# Altium project Jackson.PrjPcb (part 1 of 2)
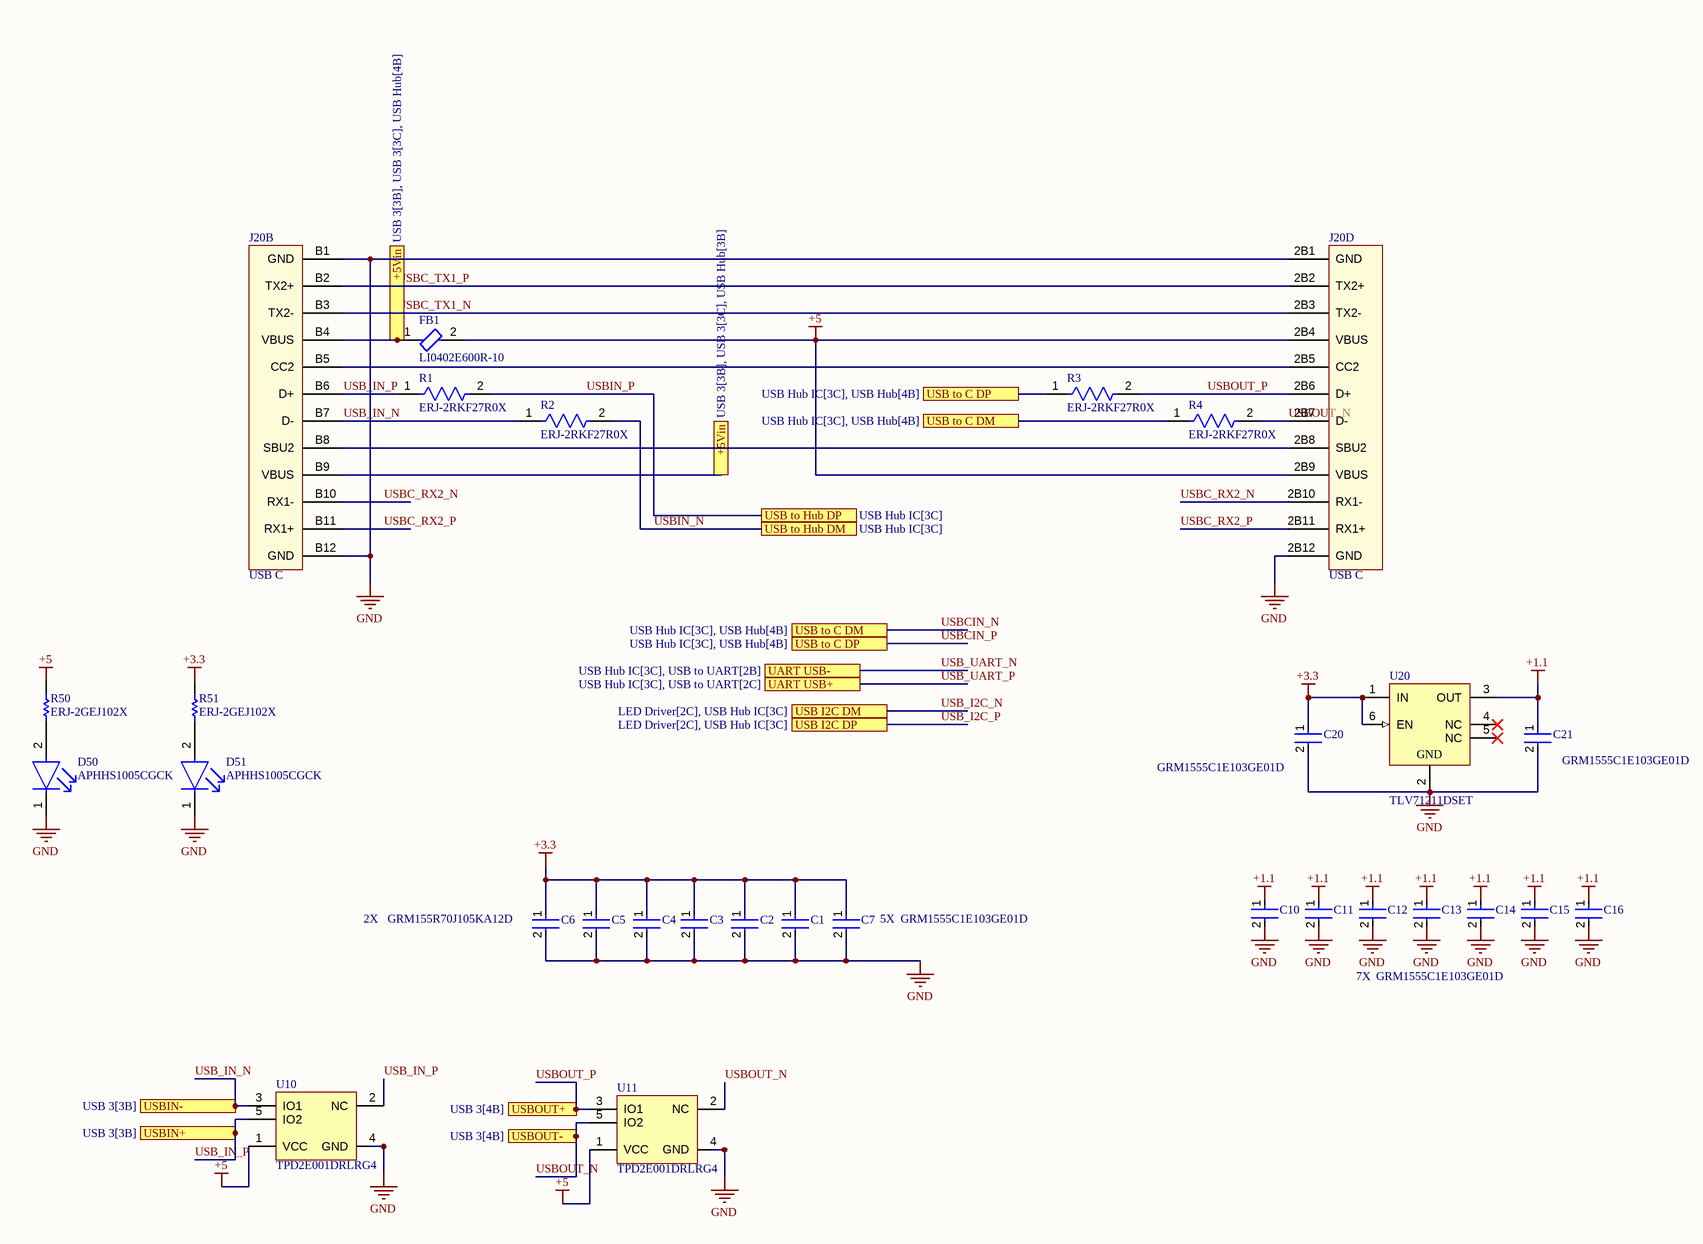
[diagram p0: USB Hub.SchDoc]
Scientist_Name_Possessive: MARY JACKSON'S; Scientist_Name: MARY JACKSON; Project_Name: JACKSON HEAD CONTROLLER; GPN_PCBA: 1184769
7 sheets, 125 parts. Net scope: flat (ports and power ports of the same name join across sheets).
Board file: Jackson.PcbDoc
Sheets:
  USB Hub.SchDoc
  USB Hub IC.SchDoc
  LED Driver.SchDoc
  USB to UART.SchDoc
  STO.SchDoc
  USB 3.SchDoc
  USB Audio.SchDoc

## Sheet USB Hub.SchDoc
size 420 x 297 mm; SheetNumber: 1; SheetTotal: 7

### Parts
C1  GRM1555C1E103GE01D  [FP-GRM155-0_15-IPC_B]  (value not drawn)
C2  GRM1555C1E103GE01D  [FP-GRM155-0_15-IPC_B]  (value not drawn)
C3  GRM1555C1E103GE01D  [FP-GRM155-0_15-IPC_B]  (value not drawn)
C4  GRM1555C1E103GE01D  [FP-GRM155-0_15-IPC_B]  (value not drawn)
C5  GRM155R70J105KA12D  [FP-GRM155-0_05-MFG]  (value not drawn)
C6  GRM155R70J105KA12D  [FP-GRM155-0_05-MFG]
C7  GRM1555C1E103GE01D  [FP-GRM155-0_15-IPC_B]
C10  GRM1555C1E103GE01D  [FP-GRM155-0_15-IPC_B]
C11  GRM1555C1E103GE01D  [FP-GRM155-0_15-IPC_B]  (value not drawn)
C12  GRM1555C1E103GE01D  [FP-GRM155-0_15-IPC_B]  (value not drawn)
C13  GRM1555C1E103GE01D  [FP-GRM155-0_15-IPC_B]  (value not drawn)
C14  GRM1555C1E103GE01D  [FP-GRM155-0_15-IPC_B]  (value not drawn)
C15  GRM1555C1E103GE01D  [FP-GRM155-0_15-IPC_B]  (value not drawn)
C16  GRM1555C1E103GE01D  [FP-GRM155-0_15-IPC_B]  (value not drawn)
C20  GRM1555C1E103GE01D  [FP-GRM155-0_15-IPC_B]
C21  GRM1555C1E103GE01D  [FP-GRM155-0_15-IPC_B]
D50  APHHS1005CGCK  [FP-APHHS1005CGCK-MFG]
D51  APHHS1005CGCK  [FP-APHHS1005CGCK-MFG]
FB1  LI0402E600R-10  [FP-LI0402-MFG]
J20  USB C  [Dual USB C Connector]  (parts B,D of 5)
R1  ERJ-2RKF27R0X  [FP-ERJ2R-IPC_B]
R2  ERJ-2RKF27R0X  [FP-ERJ2R-IPC_B]
R3  ERJ-2RKF27R0X  [FP-ERJ2R-IPC_B]
R4  ERJ-2RKF27R0X  [FP-ERJ2R-IPC_B]
R50  ERJ-2GEJ102X  [RESC1005X40X25NL05T05]
R51  ERJ-2GEJ102X  [RESC1005X40X25NL05T05]
U10  TPD2E001DRLRG4  [DRL0005A_L]
U11  TPD2E001DRLRG4  [DRL0005A_L]
U20  TLV71211DSET  [DSE0006A_V]

### Ports
+5Vin (see USB 3[3B], USB 3[3C], USB Hub[3B]), +5Vin (see USB 3[3B], USB 3[3C], USB Hub[4B]), UART USB+ (see USB Hub IC[3C], USB to UART[2C]), UART USB- (see USB Hub IC[3C], USB to UART[2B]), USB I2C DM (see LED Driver[2C], USB Hub IC[3C]), USB I2C DP (see LED Driver[2C], USB Hub IC[3C]), USB to C DM (see USB Hub IC[3C], USB Hub[4B]), USB to C DP (see USB Hub IC[3C], USB Hub[4B]), USB to Hub DM (see USB Hub IC[3C]), USB to Hub DP (see USB Hub IC[3C]), USBIN+ (see USB 3[3B]), USBIN- (see USB 3[3B]), USBOUT+ (see USB 3[4B]), USBOUT- (see USB 3[4B])

### Nets
+1.1: C10.1 C11.1 C12.1 C13.1 C14.1 C15.1 C16.1 C21.1 U20.3(OUT)
+3.3: C1.1 C2.1 C3.1 C4.1 C5.1 C6.1 C7.1 C20.1 R51.2 U20.1(IN) U20.6(EN)
+5: FB1.2 J20.2B4(VBUS) J20.2B9(VBUS) R50.2 U10.1(VCC) U11.1(VCC)
GND: C1.2 C2.2 C3.2 C4.2 C5.2 C6.2 C7.2 C10.2 C11.2 C12.2 C13.2 C14.2 C15.2 C16.2 C20.2 C21.2 D50.1(C) D51.1(C) J20.2B1(GND) J20.2B12(GND) J20.B1(GND) J20.B12(GND) U10.4(GND) U11.4(GND) U20.2(GND)
USB_IN_N: J20.B7(D-) R2.1 U10.3(IO1) ; port USBIN-
USB_IN_P: J20.B6(D+) R1.1 U10.2(NC) U10.5(IO2) ; port USBIN+
USBC_RX2_N: J20.2B10(RX1-) J20.B10(RX1-)
USBC_RX2_P: J20.2B11(RX1+) J20.B11(RX1+)
USBC_TX1_N: J20.2B3(TX2-) J20.B3(TX2-)
USBC_TX1_P: J20.2B2(TX2+) J20.B2(TX2+)
USBCIN_N: R4.1 ; port USB to C DM
USBCIN_P: R3.1 ; port USB to C DP
USBIN_N: R2.2 ; port USB to Hub DM
USBIN_P: R1.2 ; port USB to Hub DP
USBOUT_N: J20.2B7(D-) R4.2 U11.2(NC) U11.5(IO2) ; port USBOUT-
USBOUT_P: J20.2B6(D+) R3.2 U11.3(IO1) ; port USBOUT+
NetD50_2: D50.2(A) R50.1
NetD51_2: D51.2(A) R51.1
NetFB1_1: FB1.1 J20.B4(VBUS) J20.B9(VBUS) ; port +5Vin
NetJ20_2B5: J20.2B5(CC2) J20.B5(CC2)
NetJ20_2B8: J20.2B8(SBU2) J20.B8(SBU2)

Not connected (* = marked no-connect by the designer): U20 4(NC)* 5(NC)*

### Notes on the sheet
- 2X
- (near C7) 5X
- 7X
- CREATIVE COMMONS
- PUBLIC LICENSE:
- BARKOUR ROBOT
- CC BY-NC 4.0
- APPROVED
- DWG NO
- GOOGLE LLC
- FILE
- RELEASED
- 2024/05/09
- SIZE
- 1600 AMPHITHEATRE PARKWAY
- MOUNTAIN VIEW CA 94043
- A3
- SHEET
- OF
- THIS DESIGN IS BEING PROVIDED  FOR NON-COMMERCIAL USE ONLY. THE USE OF =SCIENTIST_NAME_POSSESSIVE NAME IN CONNECTION WITH THE DESIGN IS NOT INTENDED TO IMPLY THAT =SCIENTIST_NAME SPONSORS OR ENDORSES THE DESIGN, GOOGLE LLC, OR ANY OF GOOGLE LLC'S PRODUCTS OR SERVICES.

### Library data of the parts
C1-C4 C7 C10-C16 C20 C21 = CMP-06035-007392-1: Chip Multilayer Ceramic Capacitors for General Purpose, 0402, 10000pF, C0G, 30ppm/°C, 2%, 25V
C5 C6 = CMP-2008-04587-2: Chip Multilayer Ceramic Capacitors for General Purpose, 0402, 1.0uF, X7R, 15%, 10%, 6.3V; Capacitance: 1uF; Case Code (Metric): 1005; Min Operating Temperature: -55°C; Tolerance: 10%; Depth: 0.5mm; Max Operating Temperature: 125°C; Width: 0.5mm; Case Code (Imperial): 0402; Termination: SMD/SMT; Weight: 0.000212oz; Thickness: 0.022inch; Package Quantity: 10000; Packaging: Tape and Reel; Voltage Rating: 6.3V; Lead Free: Lead Free; Height: 0.5mm; Length: 1mm; Dielectric: X7R; Case/Package: 0402; Voltage Rating (DC): 6.3V; Material: Ceramic; Mount: Surface Mount
D50 D51 = CMP-44529-000044-1: LED GREEN CLEAR CHIP SMD; Viewing Angle: 120°; Dominant Wavelength: 570nm; Test Current: 20mA; Luminous Intensity: 50mcd; Forward Voltage: 2.1V; Number of LEDs: 1; Lens Color: Clear; Packaging: Tape and Reel; Max Operating Temperature: 85°C; Illumination Color: Green; Length: 1mm; Mount: Surface Mount; Lens Style: Clear; Color: Green; Number of Pins: 2; Wavelength: 570nm; Case/Package: 0402; Width: 0.5mm; Package Quantity: 2000; Case Code (Metric): 1005; Height: 0.6mm; Lead Free: Lead Free; Case Code (Imperial): 0402; Forward Current: 20mA; Min Operating Temperature: -40°C
FB1 = CMP-19111-000011-1: FERRITE BEAD 60 OHM 0402 1LN; Max DC Current: 500mA; Number of Lines: 1; DC Resistance (DCR): 300mR; Impedance: 60R; Test Frequency: 100MHz; Termination: SMD/SMT; Core Material: Ferrite; Min Operating Temperature: -40°C; Lead Free: Lead Free; Depth: 0.7mm; Max Operating Temperature: 125°C; Max Current Rating: 500mA; Case/Package: 0402; Packaging: Tape and Reel; Case Code (Metric): 1005; Package Quantity: 1; Case Code (Imperial): 0402; Frequency: 100MHz; Length: 0.04inch; Height: 0.028inch; Weight: 0.00192oz; Width: 0.02inch; Mount: Surface Mount
R1-R4 = CMP-2002-00830-2: RES SMD 27 OHM 1% 1/10W 0402; Voltage Rating: 50V; Temperature Coefficient: 100ppm/°C; Resistance: 27R; Power Rating: 100mW; Military Standard: Not; Construction: Rectangular; Tolerance: 1%; Features: Automotive AEC-Q200; Length: 1mm; Lead Free: Lead Free; Mount: Surface Mount; Number of Terminations: 2; Radiation Hardening: No; Number of Pins: 2; Width: 0.5mm; Contact Plating: Tin; Voltage Rating (DC): 50V; Resistance Tolerance: 1%; Series: ERJ; Packaging: Tape and Reel; Case/Package: 0402; Technology: THICK FILM; REACH SVHC: No SVHC; Depth: 0.5mm; Resistor Type: Thick Film; Package Quantity: 1; Termination: SMD/SMT; Case Code (Imperial): 0402; Height: 0.35mm; Weight: 2.8E-05oz; Max Operating Temperature: 155°C; Case Code (Metric): 1005; Min Operating Temperature: -55°C; RoHS Compliant: Yes; Max Power Dissipation: 100mW
R50 R51 = CMP-2002-00432-1: Manufacturer: Panasonic; Part Number: ERJ-2GEJ102X
U10 U11 = CMP-0326-00050-2: Low-Capacitance + / - 15 kV ESD-Protection Array for High-Speed Data Interfaces, 2 Channels, -40 to +85 degC, 5-pin SOT (DRL), Green (RoHS & no Sb/Br); Manufacturer: Texas Instruments; USB High Speed: TRUE; IO Leakage Current(nA): 1; IEC 61000-4-2 Contact(+/- kV): 8; Breakdown Voltage(Min)(V): 11; IEC 61000-4-2 Air-Gap(+/- kV): 15; IO Capacitance(Typ)(pF): 1.5; SubFamily: ESD Solution; Eco-Plan: Green (RoHS & no Sb/Br); PackageDescription: 5-Pin Plastic Small Outline, Flat Lead 0.5 mm Pitch; ComponentLink2Description: Datasheet; ComponentLink3URL: SamplesURL:http://www.ti.com/product/tpd2e001#samples; ComponentLink1URL: http://www.ti.com/; PartNumber: TPD2E001DRLRG4; DatasheetVersion: SLLS684F; PackageVersion: revD, Aug-2007; PackageReference: DRL0005A; ComponentLink2URL: http://www.ti.com/general/docs/lit/getliterature.tsp?genericPartNumber=TPD2E001&fileType=pdf; Mounting Technology: Surface Mount; ComponentLink1Description: Manufacturer URL; ComponentLink3Description: URL Link1
U20 = CMP-0394-01454-2: Single Output LDO, 300 mA, Fixed 1.1 V Output, 2 to 5.5 V Input, with Low IQ, 6-pin WSON (DSE), -40 to 125 degC, Green (RoHS & no Sb/Br); Manufacturer: Texas Instruments; SubFamily: Single Channel LDO; Iout(Max)(A): 0.3; Iq(Typ)(mA): 0.035; Vin(Min)(V): 2; Fixed Output Options(V): 1.1; Vdo(Typ)(mV): 260; Vin(Max)(V): 5.5; ComponentLink2Description: Datasheet; PackageVersion: 4207810/A; PackageDescription: 6-Pin Plastic Small Outline, Body 1.5 x 1.5 mm, Pitch 0.5 mm; ComponentLink1Description: Manufacturer URL; ComponentLink3Description: Package Specification; Mounting Technology: Surface Mount; Accuracy(%): 2; ComponentLink2URL: http://www.ti.com/general/docs/lit/getliterature.tsp?genericPartNumber=TLV71211&fileType=pdf; Vout Adj(Min)(V): 1.1; ComponentLink3URL: http://www.ti.com/litv/pdf/mpds287; PackageReference: DSE0006A; ComponentLink1URL: http://www.ti.com/; Eco-Plan: Green (RoHS & no Sb/Br); Vout Adj(Max)(V): 1.1; PartNumber: TLV71211DSET; DatasheetVersion: SBVS150A

## Sheet USB Hub IC.SchDoc
size 420 x 297 mm; SheetNumber: 2; SheetTotal: 7
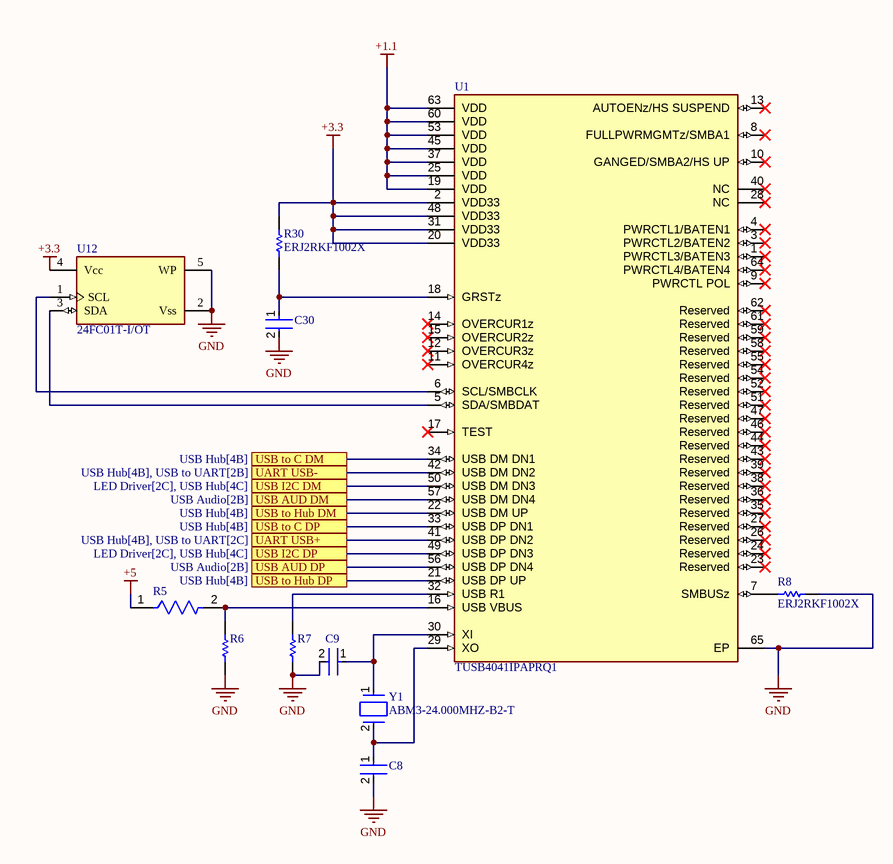
[diagram p1: USB Hub IC.SchDoc]

### Parts
C8  GJM1555C1H180JB01D  [FP-GJM155-0_05-IPC_B]  (value not drawn)
C9  GJM1555C1H180JB01D  [FP-GJM155-0_05-IPC_B]  (value not drawn)
C30  GRM1555C1E103GE01D  [FP-GRM155-0_15-IPC_B]  (value not drawn)
R5  ERJ-2RKF9092X  [FP-ERJ2RK-MFG]  (value not drawn)
R6  ERJ2RKF1002X  [RESC1005X40X25LL05T05]  (value not drawn)
R7  ERA-3AED9531V  [RESC1608X55X30ML20T20]  (value not drawn)
R8  ERJ2RKF1002X  [RESC1005X40X25LL05T05]
R30  ERJ2RKF1002X  [RESC1005X40X25LL05T05]
U1  TUSB4041IPAPRQ1  [FP-PAP0064K-MFG]
U12  24FC01T-I/OT  [FP-C04-091-OT-MFG]
Y1  ABM3-24.000MHZ-B2-T  [FP-ABM3-MFG]

### Ports
UART USB+ (see USB Hub[4B], USB to UART[2C]), UART USB- (see USB Hub[4B], USB to UART[2B]), USB AUD DM (see USB Audio[2B]), USB AUD DP (see USB Audio[2B]), USB I2C DM (see LED Driver[2C], USB Hub[4C]), USB I2C DP (see LED Driver[2C], USB Hub[4C]), USB to C DM (see USB Hub[4B]), USB to C DP (see USB Hub[4B]), USB to Hub DM (see USB Hub[4B]), USB to Hub DP (see USB Hub[4B])

### Nets
+1.1: U1.19(VDD) U1.25(VDD) U1.37(VDD) U1.45(VDD) U1.53(VDD) U1.60(VDD) U1.63(VDD)
+3.3: R30.2 U1.2(VDD33) U1.20(VDD33) U1.31(VDD33) U1.48(VDD33) U12.4(Vcc)
+5: R5.1
GND: C8.2 C9.2 C30.2 R6.1 R7.1 R8.1 U1.65(EP) U12.2(Vss) U12.5(WP)
USB_I2C_N: U1.50(USB_DM_DN3) ; port USB I2C DM
USB_I2C_P: U1.49(USB_DP_DN3) ; port USB I2C DP
USB_UART_N: U1.42(USB_DM_DN2) ; port UART USB-
USB_UART_P: U1.41(USB_DP_DN2) ; port UART USB+
USBCIN_N: U1.34(USB_DM_DN1) ; port USB to C DM
USBCIN_P: U1.33(USB_DP_DN1) ; port USB to C DP
USBIN_N: U1.22(USB_DM_UP) ; port USB to Hub DM
USBIN_P: U1.21(USB_DP_UP) ; port USB to Hub DP
NetC8_1: C8.1 U1.29(XO) Y1.2
NetC9_1: C9.1 U1.30(XI) Y1.1
NetC30_1: C30.1 R30.1 U1.18(GRSTz)
NetR5_2: R5.2 R6.2 U1.16(USB_VBUS)
NetR7_2: R7.2 U1.32(USB_R1)
NetR8_2: R8.2 U1.7(SMBUSz)
NetR600_1: U1.56(USB_DP_DN4) ; port USB AUD DP
NetR601_1: U1.57(USB_DM_DN4) ; port USB AUD DM
NetU1_5: U1.5(SDA/SMBDAT) U12.3(SDA)
NetU1_6: U1.6(SCL/SMBCLK) U12.1(SCL)

Not connected (* = marked no-connect by the designer): U1 1(PWRCTL3/BATEN3)* 3(PWRCTL2/BATEN2)* 4(PWRCTL1/BATEN1)* 8(FULLPWRMGMTz/SMBA1)* 9(PWRCTL_POL)* 10(GANGED/SMBA2/HS_UP)* 11(OVERCUR4z)* 12(OVERCUR3z)* 13(AUTOENz/HS_SUSPEND)* 14(OVERCUR1z)* 15(OVERCUR2z)* 17(TEST)* 23(Reserved)* 24(Reserved)* 26(Reserved)* 27(Reserved)* 28(NC)* 35(Reserved)* 36(Reserved)* 38(Reserved)* 39(Reserved)* 40(NC)* 43(Reserved)* 44(Reserved)* 46(Reserved)* 47(Reserved)* 51(Reserved)* 52(Reserved)* 54(Reserved)* 55(Reserved)* 58(Reserved)* 59(Reserved)* 61(Reserved)* 62(Reserved)* 64(PWRCTL4/BATEN4)*

### Notes on the sheet
- CREATIVE COMMONS
- PUBLIC LICENSE:
- BARKOUR ROBOT
- CC BY-NC 4.0
- APPROVED
- DWG NO
- GOOGLE LLC
- FILE
- RELEASED
- 2024/05/09
- SIZE
- 1600 AMPHITHEATRE PARKWAY
- MOUNTAIN VIEW CA 94043
- A3
- SHEET
- OF
- THIS DESIGN IS BEING PROVIDED  FOR NON-COMMERCIAL USE ONLY. THE USE OF =SCIENTIST_NAME_POSSESSIVE NAME IN CONNECTION WITH THE DESIGN IS NOT INTENDED TO IMPLY THAT =SCIENTIST_NAME SPONSORS OR ENDORSES THE DESIGN, GOOGLE LLC, OR ANY OF GOOGLE LLC'S PRODUCTS OR SERVICES.

### Library data of the parts
C8 C9 = CMP-2008-03807-2: Multi-Layer Ceramic Capacitor 18pF C0G  ±5% 0402 Paper T/R; Voltage: 50V; Radiation Hardening: No; Capacitance: 18pF; Depth: 0.5mm; Voltage Rating: 50V; Case/Package: 0402; Tolerance: 5%; Packaging: Tape and Reel; Height: 0.5mm; Case Code (Imperial): 0402; Width: 0.02inch; Lead Free: Lead Free; Dielectric: C0G; Package Quantity: 1; Max Operating Temperature: 125°C; Thickness: 0.022inch; Termination: SMD/SMT; Length: 1mm; Min Operating Temperature: -55°C; Mount: Surface Mount; Voltage Rating (DC): 50V; Case Code (Metric): 1005
C30 = CMP-06035-007392-1: as C1 on sheet USB Hub
R5 = CMP-1011-00731-3: RES SMD 90.9K OHM 1% 1/10W 0402; Resistance: 90.9kR; Max Power Dissipation: 100mW; Voltage Rating: 50V; Temperature Coefficient: 100ppm/°C; Military Standard: Not; Min Operating Temperature: -55°C; Resistor Type: Thick Film; Case/Package: 0402; Features: Automotive AEC-Q200; Package Quantity: 1; Packaging: Tape and Reel; Resistance Tolerance: 1%; Max Operating Temperature: 155°C; Construction: Rectangular; REACH SVHC: No SVHC; Series: ERJ; Termination: SMD/SMT; RoHS Compliant: Yes; Contact Plating: Tin; Width: 0.02inch; Number of Terminations: 2; Power Rating: 100mW; Height: 0.016inch; Voltage Rating (DC): 50V; Mount: Surface Mount; Case Code (Metric): 1005; Length: 1mm; Depth: 0.5mm; Case Code (Imperial): 0402; Tolerance: 1%
R6 R8 R30 = CMP-2000-07588-1: Chip Resistor, 10 KOhm, +/- 1%, 0.1 W, -55 to 155 degC, 0402 (1005 Metric), RoHS, Tape and Reel; Manufacturer: Panasonic; Power Rating: 100mW; Voltage Rating: 50V; Resistance: 10KOhm; Case\/Package: 0402; Temperature Coefficient: 100ppm\/degreesC; RoHSCompliant: True; Lead Free: LeadFree; Package Quantity: 1; Contact Plating: Tin; Length: 1mm; Radiation Hardening: No; REACH SVHC: NoSVHC; Max Operating Temperature: 155degC; Depth: 0.5mm; Case Code (Imperial): 0402; Military Standard: Not; Package Description: 2-Pin Surface Mount Device, Body 1 x 0.5 mm; Termination: SMD/SMT; Case Code (Metric): 1005; Height: 0.35mm; Packaging: TapeandReel; Voltage Rating (DC): 50V; Package Reference: 402; Number of Pins: 2; Tolerance: 1%; Mounting Technology: SurfaceMount; Width: 0.02inch; Mount: SurfaceMount; Datasheet URL: https://industrial.panasonic.com/cdbs/www-data/pdf/RDA0000/AOA0000C304.pdf; Composition: ThickFilm; Datasheet Version: 02/2017; Manufacturer URL: http://www.panasonic.com/; Max Power Dissipation: 100mW; Number of Terminations: 2; Min Operating Temperature: -55degC
R7 = CMP-2000-00160-1: Manufacturer: Panasonic; Part Number: ERA-3AED9531V
U1 = CMP-04877-000003-1: IC USB 2.0 4PORT HUB 64HTQFP; Manufacturer: Texas Instruments; Interface: I2C,USB,SMBus; Max Supply Voltage: 3.6V; Nominal Supply Current: 15uA; Standoff Height: 0.05mm; Min Supply Voltage: 0.99V; Usb Standard: USB 2.0; Number Of Ports: 4; Max Junction Temp: +105°C; Data Rate: 480Mbits/s; Temperature: -40°C to +85°C; ComponentLink2Description: Datasheet; Category: IC; Device Class L3: USB Interface ICs; Device Class L2: Interface ICs; Height: 1.2mm; ComponentLink2URL: http://www.ti.com/lit/ds/symlink/tusb4041i.pdf; Ipc Land Pattern Name: QFP50P1200X1200X120-64; Temperature Range High: +85°C; Lead Free: Yes; Manufacturer Part Number: TUSB4041IPAPR; Temperature Range Low: -40°C; RoHS: TRUE; Digikey Description: IC USB 2.0 4PORT HUB 64HTQFP; Device Class L1: Integrated Circuits (ICs); Ambient Temperature Range Low: -40°C; Automotive: No; Package: PAP0064K; Octopart: https://octopart.com/tusb4041ipapr-texas+instruments-61734371; Ambient Temperature Range High: +85°C
U12 = CMP-06313-000176-1: IC EEPROM 1KBIT I2C 1MHZ SOT23-5; Memory Size: 1Kb; Access Time: 450ns; Memory Type: Non-Volatile; Case/Package: SOT-23-5; Packaging: Cut Tape; Max Operating Temperature: 85°C; Min Operating Temperature: -40°C; Mount: Surface Mount; Frequency: 1MHz; Series: -; RoHS Compliant: Yes
Y1 = CMP-27762-013604-1: Crystal 24MHz ±20ppm 18pF SMD-2 5mm x 3.2mm; Series Resistance: 50R; ESR (Equivalent Series Resistance): 30R; Frequency Stability: 50ppm; Max Operating Temperature: 70°C; Resistor Type: Ceramic; Series: ABM3; REACH SVHC: Yes; Min Operating Temperature: -20°C; Lead Free: Lead Free; Number of Pins: 2; Packaging: Tape and Reel; Termination: SMD/SMT; Length: 5mm; Depth: 3.2mm; Package Quantity: 1000; Case/Package: CSMD; Accuracy: 20ppm; Height: 0.051inch; Mount: Surface Mount; Width: 3.2mm; Tolerance: 20ppm; Frequency Tolerance: 20ppm; Load Capacitance: 18pF; Operating Frequency: 24 MHz; Frequency: 24MHz; Radiation Hardening: No

## Sheet LED Driver.SchDoc
size 420 x 297 mm; SheetNumber: 3; SheetTotal: 7
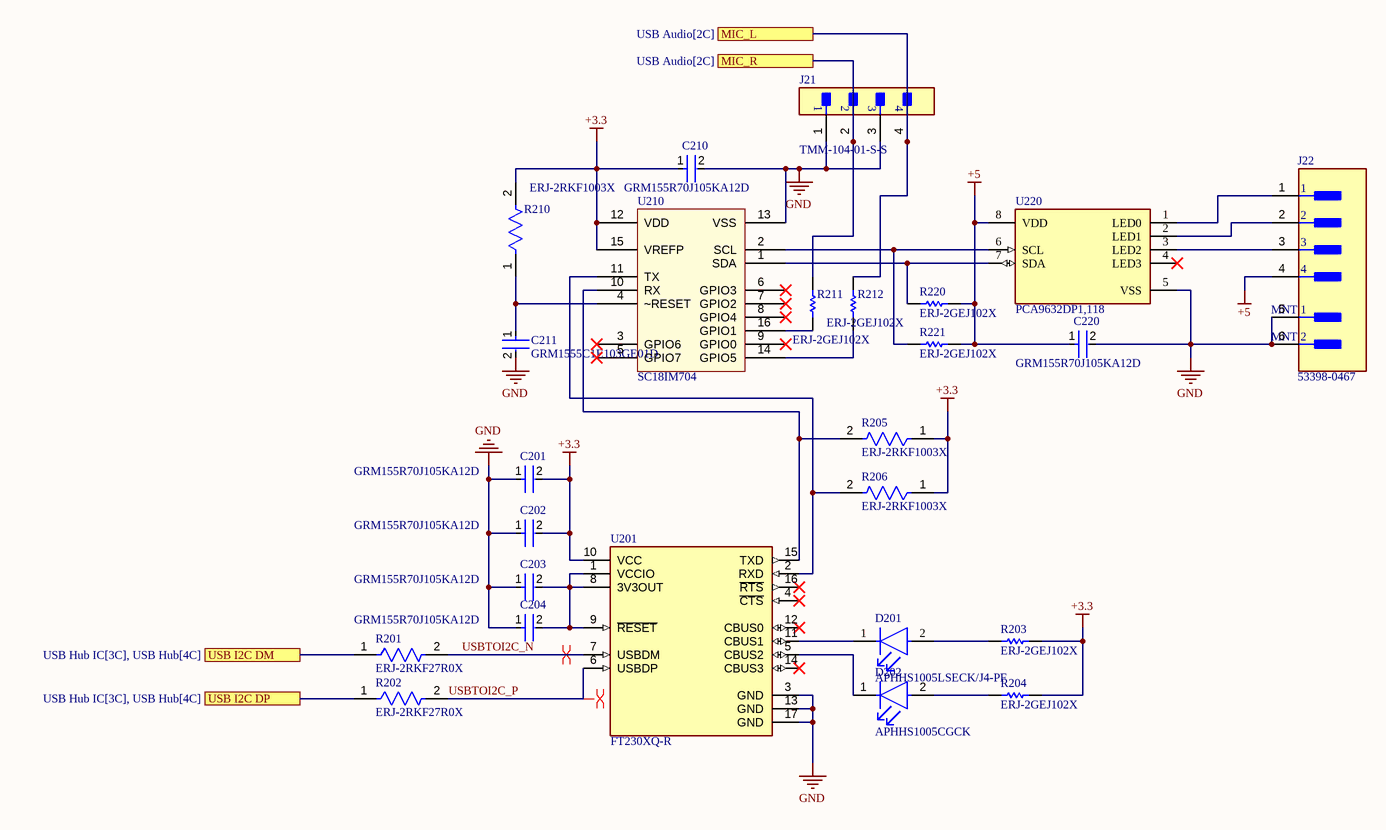
[diagram p2: LED Driver.SchDoc]

### Parts
C201  GRM155R70J105KA12D  [FP-GRM155-0_05-MFG]
C202  GRM155R70J105KA12D  [FP-GRM155-0_05-MFG]
C203  GRM155R70J105KA12D  [FP-GRM155-0_05-MFG]
C204  GRM155R70J105KA12D  [FP-GRM155-0_05-MFG]
C210  GRM155R70J105KA12D  [FP-GRM155-0_05-MFG]
C211  GRM1555C1E103GE01D  [FP-GRM155-0_15-IPC_B]
C220  GRM155R70J105KA12D  [FP-GRM155-0_05-MFG]
D201  APHHS1005LSECK/J4-PF  [FP-APHHS1005LSECK-J4-PF-MFG]
D202  APHHS1005CGCK  [FP-APHHS1005CGCK-MFG]
J21  TMM-104-01-S-S  [FP-TMM-104-01-S-S-MFG]
J22  53398-0467  [FP-53398-0467-MFG]
R201  ERJ-2RKF27R0X  [FP-ERJ2R-IPC_B]
R202  ERJ-2RKF27R0X  [FP-ERJ2R-IPC_B]
R203  ERJ-2GEJ102X  [RESC1005X40X25NL05T05]
R204  ERJ-2GEJ102X  [RESC1005X40X25NL05T05]
R205  ERJ-2RKF1003X  [FP-ERJ2RK-IPC_C]
R206  ERJ-2RKF1003X  [FP-ERJ2RK-IPC_C]
R210  ERJ-2RKF1003X  [FP-ERJ2RK-IPC_C]
R211  ERJ-2GEJ102X  [RESC1005X40X25NL05T05]
R212  ERJ-2GEJ102X  [RESC1005X40X25NL05T05]
R220  ERJ-2GEJ102X  [RESC1005X40X25NL05T05]
R221  ERJ-2GEJ102X  [RESC1005X40X25NL05T05]
U201  FT230XQ-R  [FP-QFN-16-MFG]
U210  SC18IM704  [TSSOP-16]
U220  PCA9632DP1,118  [FP-SOT505-1-IPC_C]

### Ports
MIC_L (see USB Audio[2C]), MIC_R (see USB Audio[2C]), USB I2C DM (see USB Hub IC[3C], USB Hub[4C]), USB I2C DP (see USB Hub IC[3C], USB Hub[4C])

### Nets
+3.3: C201.2 C202.2 C210.1 R203.2 R204.2 R205.1 R206.1 R210.2 U201.10(VCC) U210.12(VDD) U210.15(VREFP)
+5: C220.1 J22.4 R220.2 R221.2 U220.8(VDD)
GND: C201.1 C202.1 C203.1 C204.1 C210.2 C211.2 C220.2 J21.1 J21.3 J22.5(MNT_1) J22.6(MNT_2) U201.3(GND) U201.13(GND) U201.17(GND) U210.13(VSS) U220.5(VSS)
USB_I2C_N: R201.1 ; port USB I2C DM
USB_I2C_P: R202.1 ; port USB I2C DP
USBTOI2C_N: R201.2 U201.7(USBDM)
USBTOI2C_P: R202.2 U201.6(USBDP)
NetC203_2: C203.2 C204.2 U201.1(VCCIO) U201.8(3V3OUT) U201.9(~{RESET})
NetC211_1: C211.1 R210.1 U210.4(~RESET)
NetC607_1: J21.4 R212.2 ; port MIC_L
NetC608_1: J21.2 R211.2 ; port MIC_R
NetD201_1: D201.1(C) U201.11(CBUS1)
NetD201_2: D201.2(A) R203.1
NetD202_1: D202.1(C) U201.5(CBUS2)
NetD202_2: D202.2(A) R204.1
NetJ22_1: J22.1 U220.1(LED0)
NetJ22_2: J22.2 U220.2(LED1)
NetJ22_3: J22.3 U220.3(LED2)
NetR205_2: R205.2 U201.15(TXD) U210.10(RX)
NetR206_2: R206.2 U201.2(RXD) U210.11(TX)
NetR211_1: R211.1 U210.16(GPIO1)
NetR212_1: R212.1 U210.14(GPIO5)
NetR220_1: R220.1 U210.1(SDA) U220.7(SDA)
NetR221_1: R221.1 U210.2(SCL) U220.6(SCL)

Not connected (* = marked no-connect by the designer): U201 4(~{CTS})* 12(CBUS0)* 14(CBUS3)* 16(~{RTS})*; U210 3(GPIO6)* 5(GPIO7)* 6(GPIO3)* 7(GPIO2)* 8(GPIO4)* 9(GPIO0)*; U220 4(LED3)*

### Layout directives
differential pair: USBTOI2C_N, USBTOI2C_P

### Notes on the sheet
- CREATIVE COMMONS
- PUBLIC LICENSE:
- BARKOUR ROBOT
- CC BY-NC 4.0
- APPROVED
- DWG NO
- GOOGLE LLC
- FILE
- RELEASED
- 2024/05/09
- SIZE
- 1600 AMPHITHEATRE PARKWAY
- MOUNTAIN VIEW CA 94043
- A3
- SHEET
- OF
- THIS DESIGN IS BEING PROVIDED  FOR NON-COMMERCIAL USE ONLY. THE USE OF =SCIENTIST_NAME_POSSESSIVE NAME IN CONNECTION WITH THE DESIGN IS NOT INTENDED TO IMPLY THAT =SCIENTIST_NAME SPONSORS OR ENDORSES THE DESIGN, GOOGLE LLC, OR ANY OF GOOGLE LLC'S PRODUCTS OR SERVICES.

### Library data of the parts
C201-C204 C210 C220 = CMP-2008-04587-2: as C5 on sheet USB Hub; Case Code (Metric): 1005; Min Operating Temperature: -55°C; Tolerance: 10%; Depth: 0.5mm; Max Operating Temperature: 125°C; Width: 0.5mm; Case Code (Imperial): 0402; Termination: SMD/SMT; Weight: 0.000212oz; Thickness: 0.022inch; Package Quantity: 10000; Packaging: Tape and Reel; Voltage Rating: 6.3V; Lead Free: Lead Free; Height: 0.5mm; Length: 1mm; Dielectric: X7R; Case/Package: 0402; Voltage Rating (DC): 6.3V; Material: Ceramic; Mount: Surface Mount
C211 = CMP-06035-007392-1: as C1 on sheet USB Hub
D201 = CMP-00682-82290958-1: APHHS1005LSECK/J4-PF LED Uni-Color SB. Orange 611nm 2-Pin SMD T/R; Forward Voltage: 1.8V; Reverse Voltage: 5V; Forward Current: 2mA; Viewing Angle: 120°; Max Junction Temperature (Tj): 115°C; Luminous Intensity: 40mcd; Wavelength: 605nm; Power Dissipation: 84mW; Min Operating Temperature: -40°C; Case/Package: 0402; RoHS: Non-Compliant; Max Operating Temperature: 85°C; Schedule B: 8541402000, 8541402000; NexarPartId: 82290958; Height: 600µm; Color: Orange
D202 = CMP-44529-000044-1: as D50 on sheet USB Hub; Lens Color: Clear; Packaging: Tape and Reel; Max Operating Temperature: 85°C; Illumination Color: Green; Length: 1mm; Mount: Surface Mount; Lens Style: Clear; Color: Green; Number of Pins: 2; Wavelength: 570nm; Case/Package: 0402; Width: 0.5mm; Package Quantity: 2000; Case Code (Metric): 1005; Height: 0.6mm; Lead Free: Lead Free; Case Code (Imperial): 0402; Forward Current: 20mA; Min Operating Temperature: -40°C
J21 = CMP-02766-001674-1: CONN HEADER VERT 4POS 2MM; Max Current Rating: 3.9A; Connector Type: Male Pin; Max Voltage Rating (AC): 500V; Number of Contacts: 4; Gender: Male; Color: Black; Packaging: Bulk; Orientation: Straight; Contact Mating Length: 0.126inch; Contact Plating: Gold; Max Operating Temperature: 125°C; Housing Color: Black; Contact Material: Bronze; Package Quantity: 1; Housing Material: Polymer; Radiation Hardening: No; Pitch: 2mm; Contact Type: Male Pin; Number of Positions: 4; Number of Rows: 1; Lead Free: Lead Free; Width: 1.97mm; Termination: Solder; Depth: 1.97mm; Series: FleXYZ™ TMM; RoHS Compliant: Yes; Length: 8mm; Min Operating Temperature: -55°C; Mount: Through Hole
J22 = CMP-04776-000301-1: CONN HEADER SMD 4POS 1.25MM; Contact Resistance: 20mR; Max Voltage Rating (AC): 125V; Current Rating: 1A; Number of Positions: 4; Mount: Surface Mount; Pitch: 1.25mm; Orientation: Straight; Housing Material: Nylon; Max Operating Temperature: 85°C; Packaging: Tape and Reel; RoHS Compliant: Yes; Contact Gender: Male; Min Operating Temperature: -40°C; Radiation Hardening: No; Number of Contacts: 4; Termination: Solder; Contact Plating: Tin; Voltage Rating: 125V; Number of Rows: 1; Contact Material: Bronze
R201 R202 = CMP-2002-00830-2: as R1 on sheet USB Hub; Military Standard: Not; Construction: Rectangular; Tolerance: 1%; Features: Automotive AEC-Q200; Length: 1mm; Lead Free: Lead Free; Mount: Surface Mount; Number of Terminations: 2; Radiation Hardening: No; Number of Pins: 2; Width: 0.5mm; Contact Plating: Tin; Voltage Rating (DC): 50V; Resistance Tolerance: 1%; Series: ERJ; Packaging: Tape and Reel; Case/Package: 0402; Technology: THICK FILM; REACH SVHC: No SVHC; Depth: 0.5mm; Resistor Type: Thick Film; Package Quantity: 1; Termination: SMD/SMT; Case Code (Imperial): 0402; Height: 0.35mm; Weight: 2.8E-05oz; Max Operating Temperature: 155°C; Case Code (Metric): 1005; Min Operating Temperature: -55°C; RoHS Compliant: Yes; Max Power Dissipation: 100mW
R203 R204 R211 R212 R220 R221 = CMP-2002-00432-1: Manufacturer: Panasonic; Part Number: ERJ-2GEJ102X
R205 R206 R210 = CMP-2002-00608-4: RES SMD 100K OHM 1% 1/10W 0402; Resistance: 100kR; Voltage Rating (DC): 50V; Power Rating: 100mW; Temperature Coefficient: 100ppm/°C; Case/Package: 0402; Length: 1mm; Package Quantity: 1; Radiation Hardening: No; Case Code (Metric): 1005; Contact Plating: Tin; Mount: Surface Mount; Depth: 0.5mm; Max Operating Temperature: 155°C; Lead Free: Lead Free; Width: 0.5mm; Composition: Thick Film; Case Code (Imperial): 0402; Tolerance: 1%; Termination: SMD/SMT; Number of Pins: 2; Height: 0.35mm; Voltage Rating: 50V; Military Standard: Not; REACH SVHC: No SVHC; Packaging: Tape and Reel; Min Operating Temperature: -55°C; Max Power Dissipation: 100mW; Features: Automotive AEC-Q200; Number of Terminations: 2
U201 = CMP-0248-00010-3: IC USB SERIAL BASIC UART 16QFN; Number of Channels: 1; Data Rate: 12Mbps; Operating Supply Current: 8mA; Max Supply Voltage: 5.5V; Operating Supply Voltage: 5V; Min Supply Voltage: 2.97V; Width: 4mm; Length: 4mm; Height: 0.75mm; Max Operating Temperature: 85°C; Interface: USB; Min Operating Temperature: -40°C; Package Quantity: 5000; Lead Free: Lead Free; Number of Pins: 16; Case/Package: QFN; Weight: 0.002014oz; Packaging: Tape and Reel; Mount: Surface Mount
U220 = CMP-10140-000008-1: IC LED DRVR LIN DIM 25MA 8TSSOP; Low Level Output Current: 100mA; Frequency: 400kHz; Power Dissipation: 400mW; Output Voltage: 5.5V; Number of Outputs: 4; Max Supply Current: 150uA; Min Supply Voltage: 2.3V; Package Quantity: 1; Number of Pins: 8; Max Power Dissipation: 400mW; Series: -; Max Supply Voltage: 5.5V; Lead Free: Lead Free; Radiation Hardening: No; Supply Current: 150uA; Nominal Supply Current: 150uA; Case/Package: TSSOP; Max Operating Temperature: 85°C; Mount: Surface Mount; Packaging: Tape and Reel; RoHS Compliant: Yes; Number of Segments: 4; Min Operating Temperature: -40°C

## Sheet USB to UART.SchDoc
size 420 x 297 mm; SheetNumber: 4; SheetTotal: 7
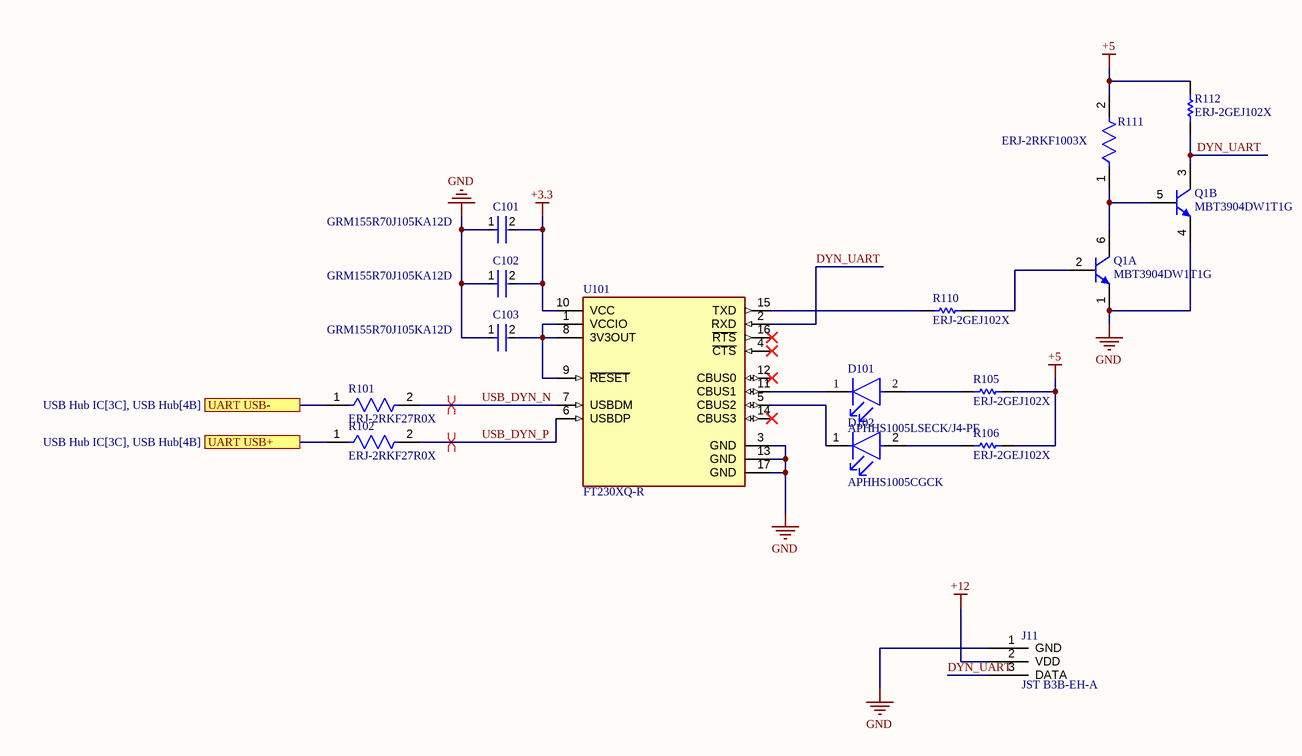
[diagram p3: USB to UART.SchDoc]

### Parts
C101  GRM155R70J105KA12D  [FP-GRM155-0_05-MFG]
C102  GRM155R70J105KA12D  [FP-GRM155-0_05-MFG]
C103  GRM155R70J105KA12D  [FP-GRM155-0_05-MFG]
D101  APHHS1005LSECK/J4-PF  [FP-APHHS1005LSECK-J4-PF-MFG]
D102  APHHS1005CGCK  [FP-APHHS1005CGCK-MFG]
J11  JST B3B-EH-A  [JST B3B-EH-A]
Q1  MBT3904DW1T1G  [ONSC-SOT-363-6-419B-02_W_V]  (parts A,B of 2)
R101  ERJ-2RKF27R0X  [FP-ERJ2R-IPC_B]
R102  ERJ-2RKF27R0X  [FP-ERJ2R-IPC_B]
R105  ERJ-2GEJ102X  [RESC1005X40X25NL05T05]
R106  ERJ-2GEJ102X  [RESC1005X40X25NL05T05]
R110  ERJ-2GEJ102X  [RESC1005X40X25NL05T05]
R111  ERJ-2RKF1003X  [FP-ERJ2RK-IPC_C]
R112  ERJ-2GEJ102X  [RESC1005X40X25NL05T05]
U101  FT230XQ-R  [FP-QFN-16-MFG]

### Ports
UART USB+ (see USB Hub IC[3C], USB Hub[4B]), UART USB- (see USB Hub IC[3C], USB Hub[4B])

### Nets
+3.3: C101.2 C102.2 U101.10(VCC)
+5: R105.2 R106.2 R111.2 R112.2
+12: J11.2(VDD)  [project net Dynamixel 12V]
GND: C101.1 C102.1 C103.1 J11.1(GND) Q1.1(E) Q1.4(E) U101.3(GND) U101.13(GND) U101.17(GND)
DYN_UART: J11.3(DATA) Q1.3(C) R112.1 U101.2(RXD)
USB_DYN_N: R101.2 U101.7(USBDM)
USB_DYN_P: R102.2 U101.6(USBDP)
USB_UART_N: R101.1 ; port UART USB-
USB_UART_P: R102.1 ; port UART USB+
NetC103_2: C103.2 U101.1(VCCIO) U101.8(3V3OUT) U101.9(~{RESET})
NetD101_1: D101.1(C) U101.11(CBUS1)
NetD101_2: D101.2(A) R105.1
NetD102_1: D102.1(C) U101.5(CBUS2)
NetD102_2: D102.2(A) R106.1
NetQ1_2: Q1.2(B) R110.2
NetQ1_5: Q1.5(B) Q1.6(C) R111.1
NetR110_1: R110.1 U101.15(TXD)

Not connected (* = marked no-connect by the designer): U101 4(~{CTS})* 12(CBUS0)* 14(CBUS3)* 16(~{RTS})*

### Layout directives
differential pair: USB_DYN_N, USB_DYN_P

### Notes on the sheet
- CREATIVE COMMONS
- PUBLIC LICENSE:
- BARKOUR ROBOT
- CC BY-NC 4.0
- APPROVED
- DWG NO
- GOOGLE LLC
- FILE
- RELEASED
- 2024/05/09
- SIZE
- 1600 AMPHITHEATRE PARKWAY
- MOUNTAIN VIEW CA 94043
- A3
- SHEET
- OF
- THIS DESIGN IS BEING PROVIDED  FOR NON-COMMERCIAL USE ONLY. THE USE OF =SCIENTIST_NAME_POSSESSIVE NAME IN CONNECTION WITH THE DESIGN IS NOT INTENDED TO IMPLY THAT =SCIENTIST_NAME SPONSORS OR ENDORSES THE DESIGN, GOOGLE LLC, OR ANY OF GOOGLE LLC'S PRODUCTS OR SERVICES.

### Library data of the parts
C101-C103 = CMP-2008-04587-2: as C5 on sheet USB Hub; Case Code (Metric): 1005; Min Operating Temperature: -55°C; Tolerance: 10%; Depth: 0.5mm; Max Operating Temperature: 125°C; Width: 0.5mm; Case Code (Imperial): 0402; Termination: SMD/SMT; Weight: 0.000212oz; Thickness: 0.022inch; Package Quantity: 10000; Packaging: Tape and Reel; Voltage Rating: 6.3V; Lead Free: Lead Free; Height: 0.5mm; Length: 1mm; Dielectric: X7R; Case/Package: 0402; Voltage Rating (DC): 6.3V; Material: Ceramic; Mount: Surface Mount
D101 = CMP-00682-82290958-1: as D201 on sheet LED Driver; Min Operating Temperature: -40°C; Case/Package: 0402; RoHS: Non-Compliant; Max Operating Temperature: 85°C; Schedule B: 8541402000, 8541402000; NexarPartId: 82290958; Height: 600µm; Color: Orange
D102 = CMP-44529-000044-1: as D50 on sheet USB Hub; Lens Color: Clear; Packaging: Tape and Reel; Max Operating Temperature: 85°C; Illumination Color: Green; Length: 1mm; Mount: Surface Mount; Lens Style: Clear; Color: Green; Number of Pins: 2; Wavelength: 570nm; Case/Package: 0402; Width: 0.5mm; Package Quantity: 2000; Case Code (Metric): 1005; Height: 0.6mm; Lead Free: Lead Free; Case Code (Imperial): 0402; Forward Current: 20mA; Min Operating Temperature: -40°C
Q1 = CMP-1048-00877-1: Dual General Purpose Transistors, 6-Pin SOT-363, Pb-Free, Tape and Reel; Manufacturer: On Semiconductor; Polarity: Dual NPN; fT Min (MHz): 300; IC Continuous (A): 0.2; DatasheetVersion: Rev. 9; ComponentLink2Description: Datasheet; Mounting Technology: Surface Mount; PackageReference: SOT-363-6-419B-02_W; RoHS: TRUE; ComponentLink1Description: Manufacturer URL; ComponentLink2URL: http://www.onsemi.com/pub_link/Collateral/MBT3904DW1T1-D.PDF; PackageVersion: Rev. W, 01/2006; Packing: Tape and Reel; PartNumber: MBT3904DW1T1G; ComponentLink1URL: http://www.onsemi.com/; ComponentLink3URL: http://www.onsemi.com/pub_link/Collateral/NTJD4001N-D.PDF; ComponentLink3Description: Package Specification; PackageDescription: 6-Pin Small Outline Transistor, Body 2 x 1.25 mm, Pitch 0.65 mm
R101 R102 = CMP-2002-00830-2: as R1 on sheet USB Hub; Military Standard: Not; Construction: Rectangular; Tolerance: 1%; Features: Automotive AEC-Q200; Length: 1mm; Lead Free: Lead Free; Mount: Surface Mount; Number of Terminations: 2; Radiation Hardening: No; Number of Pins: 2; Width: 0.5mm; Contact Plating: Tin; Voltage Rating (DC): 50V; Resistance Tolerance: 1%; Series: ERJ; Packaging: Tape and Reel; Case/Package: 0402; Technology: THICK FILM; REACH SVHC: No SVHC; Depth: 0.5mm; Resistor Type: Thick Film; Package Quantity: 1; Termination: SMD/SMT; Case Code (Imperial): 0402; Height: 0.35mm; Weight: 2.8E-05oz; Max Operating Temperature: 155°C; Case Code (Metric): 1005; Min Operating Temperature: -55°C; RoHS Compliant: Yes; Max Power Dissipation: 100mW
R105 R106 R110 R112 = CMP-2002-00432-1: Manufacturer: Panasonic; Part Number: ERJ-2GEJ102X
R111 = CMP-2002-00608-4: as R205 on sheet LED Driver; Case/Package: 0402; Length: 1mm; Package Quantity: 1; Radiation Hardening: No; Case Code (Metric): 1005; Contact Plating: Tin; Mount: Surface Mount; Depth: 0.5mm; Max Operating Temperature: 155°C; Lead Free: Lead Free; Width: 0.5mm; Composition: Thick Film; Case Code (Imperial): 0402; Tolerance: 1%; Termination: SMD/SMT; Number of Pins: 2; Height: 0.35mm; Voltage Rating: 50V; Military Standard: Not; REACH SVHC: No SVHC; Packaging: Tape and Reel; Min Operating Temperature: -55°C; Max Power Dissipation: 100mW; Features: Automotive AEC-Q200; Number of Terminations: 2
U101 = CMP-0248-00010-3: as U201 on sheet LED Driver; Width: 4mm; Length: 4mm; Height: 0.75mm; Max Operating Temperature: 85°C; Interface: USB; Min Operating Temperature: -40°C; Package Quantity: 5000; Lead Free: Lead Free; Number of Pins: 16; Case/Package: QFN; Weight: 0.002014oz; Packaging: Tape and Reel; Mount: Surface Mount

## Sheet STO.SchDoc
size 420 x 297 mm; SheetNumber: 5; SheetTotal: 7
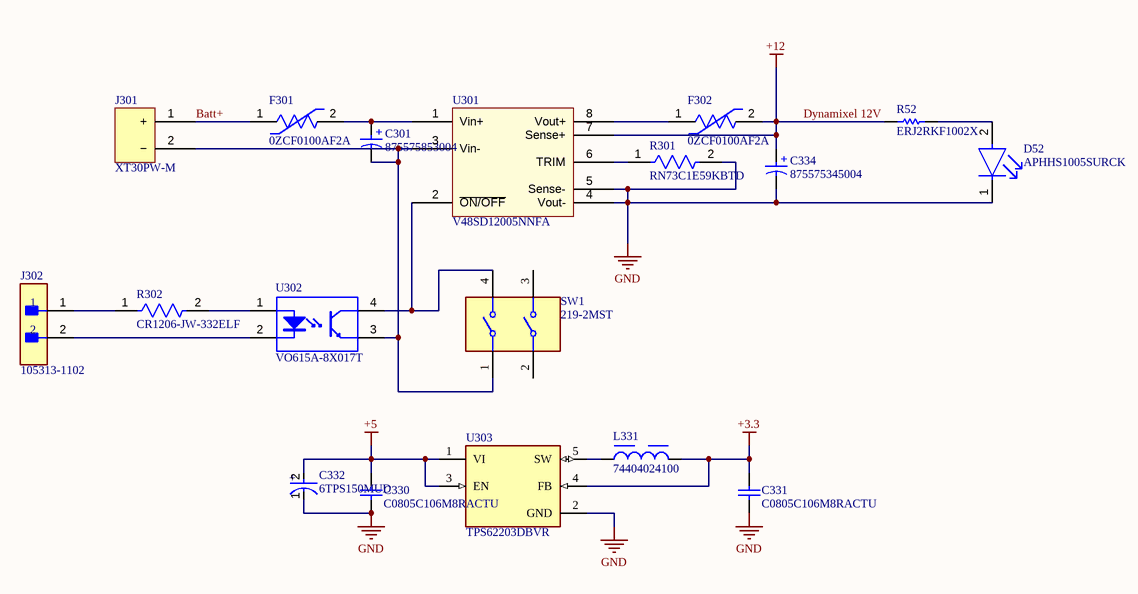
[diagram p4: STO.SchDoc]

### Parts
C301  875575853004  [WCAP-HSG5_D8H10.5]
C330  C0805C106M8RACTU  [CAPC2013X140X50NL20T25]
C331  C0805C106M8RACTU  [CAPC2013X140X50NL20T25]
C332  6TPS150MUD  [FP-POSCAP-B1S-MFG]
C334  875575345004  [WCAP-HSG5_D6.3H7.7]
D52  APHHS1005SURCK  [FP-APHHS1005SURCK-MFG]
F301  0ZCF0100AF2A  [FP-0ZCF0100AF2A-MFG]
F302  0ZCF0100AF2A  [FP-0ZCF0100AF2A-MFG]
J301  XT30PW-M  [XT30PW_M]
J302  105313-1102  [FP-105313-1102-MFG]
L331  74404024100  [WE-LQS_2512]
R52  ERJ2RKF1002X  [RESC1005X40X25LL05T05]
R301  RN73C1E59KBTD  [FP-RN731E-MFG]
R302  CR1206-JW-332ELF  [FP-CR1206-IPC_B]
SW1  219-2MST  [FP-219-2MST-MFG]
U301  V48SD12005NNFA  [1/16 Brick]
U302  VO615A-8X017T  [VISH-VO615A-XX017T_V]
U303  TPS62203DBVR  [FP-DBV0005A-IPC_B]

### Nets
+3.3: C331.2 L331.2 U303.4(FB)
+5: C330.1 C332.2(A) U303.1(VI) U303.3(EN)
Dynamixel 12V: C334.1(P) F302.2 R52.2 U301.7(Sense+)  [also labelled +12]
GND: C330.2 C331.1 C332.1(C) C334.2(N) D52.1(C) R301.2 U301.4(Vout-) U301.5(Sense-) U303.2(GND)
Batt+: F301.1 J301.1(+)
NetC301_1: C301.1(P) F301.2 U301.1(Vin+)
NetC301_2: C301.2(N) J301.2(−) SW1.1 U301.3(Vin-) U302.3(EMITTER)
NetD52_2: D52.2(A) R52.1
NetF302_1: F302.1 U301.8(Vout+)
NetJ302_1: J302.1 R302.1
NetJ302_2: J302.2 U302.2(CATHODE)
NetL331_1: L331.1 U303.5(SW)
NetR301_1: R301.1 U301.6(TRIM)
NetR302_2: R302.2 U302.1(ANODE)
NetSW1_4: SW1.4 U301.2(~{ON/OFF}) U302.4(COLLECTOR)

Not connected (* = marked no-connect by the designer): SW1 2 3

### Notes on the sheet
- CREATIVE COMMONS
- PUBLIC LICENSE:
- BARKOUR ROBOT
- CC BY-NC 4.0
- APPROVED
- DWG NO
- GOOGLE LLC
- FILE
- RELEASED
- 2024/05/09
- SIZE
- 1600 AMPHITHEATRE PARKWAY
- MOUNTAIN VIEW CA 94043
- A3
- SHEET
- OF
- THIS DESIGN IS BEING PROVIDED  FOR NON-COMMERCIAL USE ONLY. THE USE OF =SCIENTIST_NAME_POSSESSIVE NAME IN CONNECTION WITH THE DESIGN IS NOT INTENDED TO IMPLY THAT =SCIENTIST_NAME SPONSORS OR ENDORSES THE DESIGN, GOOGLE LLC, OR ANY OF GOOGLE LLC'S PRODUCTS OR SERVICES.
- (in symbol CMP-03913-134709149-1) +
- (in symbol CMP-03913-134709168-1) +
- (in symbol CMP-05428-000345-1) +

### Library data of the parts
C301 = CMP-03913-134709168-1: 875575853004 Cap, 47Uf, 63V, Alu Elec, Hybrid, Smd Rohs Compliant: Yes; ESR (Equivalent Series Resistance): 40mΩ; Ripple Current: 1.7A; Leakage Current: 29.6µA; Capacitance: 47µF; NexarPartId: 134709168; Diameter: 8mm; Length: 10.5mm; Max Operating Temperature: 105°C; RoHS: Compliant; Voltage Rating: 63V; Width: 8.3mm; Min Operating Temperature: -55°C
C330 C331 = CMP-2007-03245-1: Manufacturer: Kemet; Part Number: C0805C106M8RACTU
C332 = CMP-05428-000345-1: Molded Tantalum Polymer Capacitor 150uF 20% 6.3V life 2000Hours SMD 1411; RoHS Compliant: Yes
C334 = CMP-03913-134709149-1: 875575345004 Cap, 220Uf, 16V, Alu Elec, Hybrid, Smd Rohs Compliant: Yes; Ripple Current: 2A; Leakage Current: 35.2µA; ESR (Equivalent Series Resistance): 30mΩ; Capacitance: 220µF; NexarPartId: 134709149; Max Operating Temperature: 105°C; Voltage Rating: 16V; Diameter: 6.3mm; RoHS: Compliant; Min Operating Temperature: -55°C; Width: 6.5mm; Length: 7.7mm
D52 = CMP-2000-05787-2: LED RED CLEAR CHIP SMD; Forward Current: 20mA; Number of LEDs: 1; Dominant Wavelength: 630nm; Luminous Intensity: 220mcd; Wavelength: 635nm; Forward Voltage: 1.95V; Viewing Angle: 120°; Case/Package: 0402; Length: 1mm; Packaging: Tape and Reel; Lens Color: Clear; Width: 0.5mm; Test Current: 20mA; Lead Free: Lead Free; Min Operating Temperature: -40°C; Illumination Color: Red; Max Operating Temperature: 85°C; Mount: Surface Mount; Package Quantity: 2000; Lens Style: Clear; Case Code (Imperial): 0402; Height: 0.6mm; Number of Pins: 2; Case Code (Metric): 1005; Color: Red
F301 F302 = CMP-16043-000014-1: PTC RESET FUSE 60V 1A 2920; Trip Current: 2A; Time to Trip: 0.5s; Max Current Rating: 100A; Case Code (Imperial): 2920; Thickness: 0.067inch; Case Code (Metric): 7351; Hold Current: 1A; Packaging: Tape and Reel; Length: 0.29inch; Width: 0.202inch; RoHS Compliant: Yes; Mount: Surface Mount
J301 = XT30PW-M: Amass XT30 RA TH male header; Manufacturer: Amass; Manufacturer Part Number: XT30PW-M
J302 = CMP-04776-000341-1: CONN HEADER R/A 2POS 2.5MM
L331 = CMP-1354-00007-2: NexarPartId: 46948232; Self Resonant Frequency: 30MHz; Max DC Current: 470mA; Inductance Tolerance: 20%; Core Material: Ferrite; Saturation Current: 850mA; DC Resistance (DCR): 430mΩ; Shielding: Shielded; Current Rating: 650mA; Inductance: 10µH; Test Frequency: 1MHz; Composition: Wirewound; Mount: Surface Mount; Ambient Temperature Range High: 85°C; Height: 1.2mm; Height - Seated (Max): 1.1938mm; Packaging: Tape & Reel (TR); Ambient Temperature Range Low: -40°C; RoHS: Compliant; Weight: 32.006612mg; Termination: SMD/SMT; Max Operating Temperature: 125°C; Min Operating Temperature: -40°C; Width: 2mm; RMS Current (Irms): 470mA; Case/Package: Nonstandard; REACH SVHC: Unknown; Length: 2.5mm; Tolerance: 20%
R52 = CMP-2000-07588-1: as R6 on sheet USB Hub IC; RoHSCompliant: True; Lead Free: LeadFree; Package Quantity: 1; Contact Plating: Tin; Length: 1mm; Radiation Hardening: No; REACH SVHC: NoSVHC; Max Operating Temperature: 155degC; Depth: 0.5mm; Case Code (Imperial): 0402; Military Standard: Not; Package Description: 2-Pin Surface Mount Device, Body 1 x 0.5 mm; Termination: SMD/SMT; Case Code (Metric): 1005; Height: 0.35mm; Packaging: TapeandReel; Voltage Rating (DC): 50V; Package Reference: 402; Number of Pins: 2; Tolerance: 1%; Mounting Technology: SurfaceMount; Width: 0.02inch; Mount: SurfaceMount; Datasheet URL: https://industrial.panasonic.com/cdbs/www-data/pdf/RDA0000/AOA0000C304.pdf; Composition: ThickFilm; Datasheet Version: 02/2017; Manufacturer URL: http://www.panasonic.com/; Max Power Dissipation: 100mW; Number of Terminations: 2; Min Operating Temperature: -55degC
R301 = CMP-03211-010675-1: Res Thin Film 0402 59KΩ 0.1% 1/16W 10ppm/°C Molded SMD; Manufacturer: TE Connectivity; Voltage Rating: 25V; Power Rating: 0.063W; Temperature: -55°C to +155°C; Temperature Range Low: -55°C; ComponentLink2URL: https://www.te.com/commerce/DocumentDelivery/DDEController?Action=showdoc&DocId=Data+Sheet%7F1773270%7FP%7Fpdf%7FEnglish%7FENG_DS_1773270_P.pdf%7F1-1879132-6; Octopart: https://octopart.com/rn73c1e59kbtd-te+connectivity-76703336; Manufacturer Part Number: RN73C1E59KBTD; packaging: 5000 Reel; Lead Free: Yes; Ipc Land Pattern Name: RESC10050X30; Temperature Range High: +155°C; Device Class L1: Passive Components; octopart_url: https://octopart.com/rn73c1e59kbtd-te+connectivity-76703336; Resistance: 59KΩ; Height: 0.35mm; Value: 59KΩ; Device Class L2: Resistors; Tolerance: 0.1%; Category: Res; Package: RN731E; RoHS: TRUE; Series: RN73; Temperature Coefficient: 10ppm/°C; Automotive: No; Device Class L3: Chip SMD Resistors; ComponentLink2Description: Datasheet; Composition: Thin Film
R302 = CMP-07231-005113-1: Thick Film Chip Resistors 1206 3.3kΩ 0.25W 5% 200ppm/°C; Power Rating: 250mW; Resistance: 3.3kR; Voltage Rating: 200V; Contact Plating: Tin; Depth: 1.6mm; Mount: Surface Mount; Width: 1.6mm; Number of Terminations: 2; Military Standard: Not; Length: 3.2mm; Features: Moisture Resistant; Radiation Hardening: No; Package Quantity: 5000; Case/Package: 1206; Case Code (Imperial): 1206; Packaging: Tape and Reel; Case Code (Metric): 3216; Thickness: 610um; Composition: Thick Film; Max Operating Temperature: 155°C; Max Power Dissipation: 250mW; Temperature Coefficient: 200ppm/°C; Tolerance: 5%; Min Operating Temperature: -55°C; Height: 0.03inch; Termination: SMD/SMT
SW1 = CMP-07018-000006-1: SWITCH SLIDE DIP SPST 100MA 20V; Mechanical Life: 2000Cycles; Number of Positions: 2; Actuator Type: Slide (Standard); Contact Resistance: 25mR; Actuator Length: 0.25mm; Pitch: 0.1inch; Washable: Yes; Length: 0.258inch; Orientation: Straight; Package Quantity: 85; Mount: Surface Mount; Contact Plating: Gold; Packaging: Rail/Tube; RoHS Compliant: Yes; Max Current Rating: 100mA; Throw Configuration: SPST; Terminal Pitch: 2.54mm; Depth: 9.91mm; Radiation Hardening: No; Contact Material: Copper; Voltage Rating (DC): 20V; Max Operating Temperature: 85°C; Termination: Gull Wing; Max Voltage Rating (DC): 20V; Current Rating: 100mA; Electrical Life: 2000Cycles; Height: 4.05mm; Min Operating Temperature: -55°C
U302 = CMP-2000-07399-1: Optocoupler, Phototransistor Output, High Temperature, 5000 VRMS, -55 to 110 degC, 4-Pin SMD, RoHS, Tape and Reel; Manufacturer: Vishay; Vce Saturation (Max): 300mV; Turn On / Turn Off Time (Typ): 6µs,5µs; Minimum Quantity: 1; Other Names: VO615A-8X017TDKR; Current - Output / Channel: 50mA; Current - DC Forward (If): 60mA; Voltage - Forward (Vf) (Typ): 1.43V; Current Transfer Ratio (Max): 260%@5mA; Input Type: DC; Dynamic Catalog: VOS615A,VOS617A,VOS618ASeries; Rise / Fall Time (Typ): 3µs,4.7µs; Current Transfer Ratio (Min): 130%@5mA; Voltage - Output (Max): 70V; Packaging: Digi-Reel®; Package Description: 4-Pin Surface Mount Device, Body 6.5 x 4.58 mm, Pitch 2.54 mm; Voltage - Isolation: 5000Vrms; Standard Package: 1; Category: Isolators; Output Type: Transistor; Datasheet URL: http://www.vishay.com/docs/81753/vo615a.pdf; Manufacturer URL: http://www.vishay.com/; Quantity Available: Tape&Reel(TR)AlternatePackaging; Package/Case: 4-SMD,GullWing; Operating Temperature: -55°C~110°C; Supplier Device Package: 4-SMD; Family: Optoisolators-Transistor,PhotovoltaicOutput; Current - DC Forward (If) (Max): 60mA; Package Reference: VO615A-XX017T; Datasheet Version: Rev. 2.2, 09/2013; Package / Case: 4-SMD,GullWing; Mounting Type: SurfaceMount; Mounting Technology: SurfaceMount; Number of Channels: 1; Voltage - Output: 70V
U303 = CMP-04918-000656-1: IC REG BUCK 3.3V 300MA SOT23-5; Number of Outputs: 1; Nominal Supply Current: 15uA; Operating Supply Voltage: 6V; Min Input Voltage: 2.5V; Efficiency: 95%; Synchronous Rectifier: Yes; Output Type: Fixed; Switching Frequency: 1MHz; Output Configuration: Positive; Number of Pins: 5; Max Operating Temperature: 85°C; Output Voltage: 3.3V; Lead Free: Lead Free; Package Quantity: 3000; Output Current: 300mA; Min Output Voltage: 3.3V; Min Operating Temperature: -40°C; Packaging: Tape and Reel; Max Output Current: 300mA; Min Supply Voltage: 2.5V; RoHS Compliant: Yes; Supply Current: 15uA; Radiation Hardening: No; Quiescent Current: 15uA; Series: -; Contact Plating: Gold; Mount: Surface Mount; Case/Package: SOT-23-5; Max Input Voltage: 6V

## Sheet USB 3.SchDoc
size 420 x 297 mm; SheetNumber: 6; SheetTotal: 7
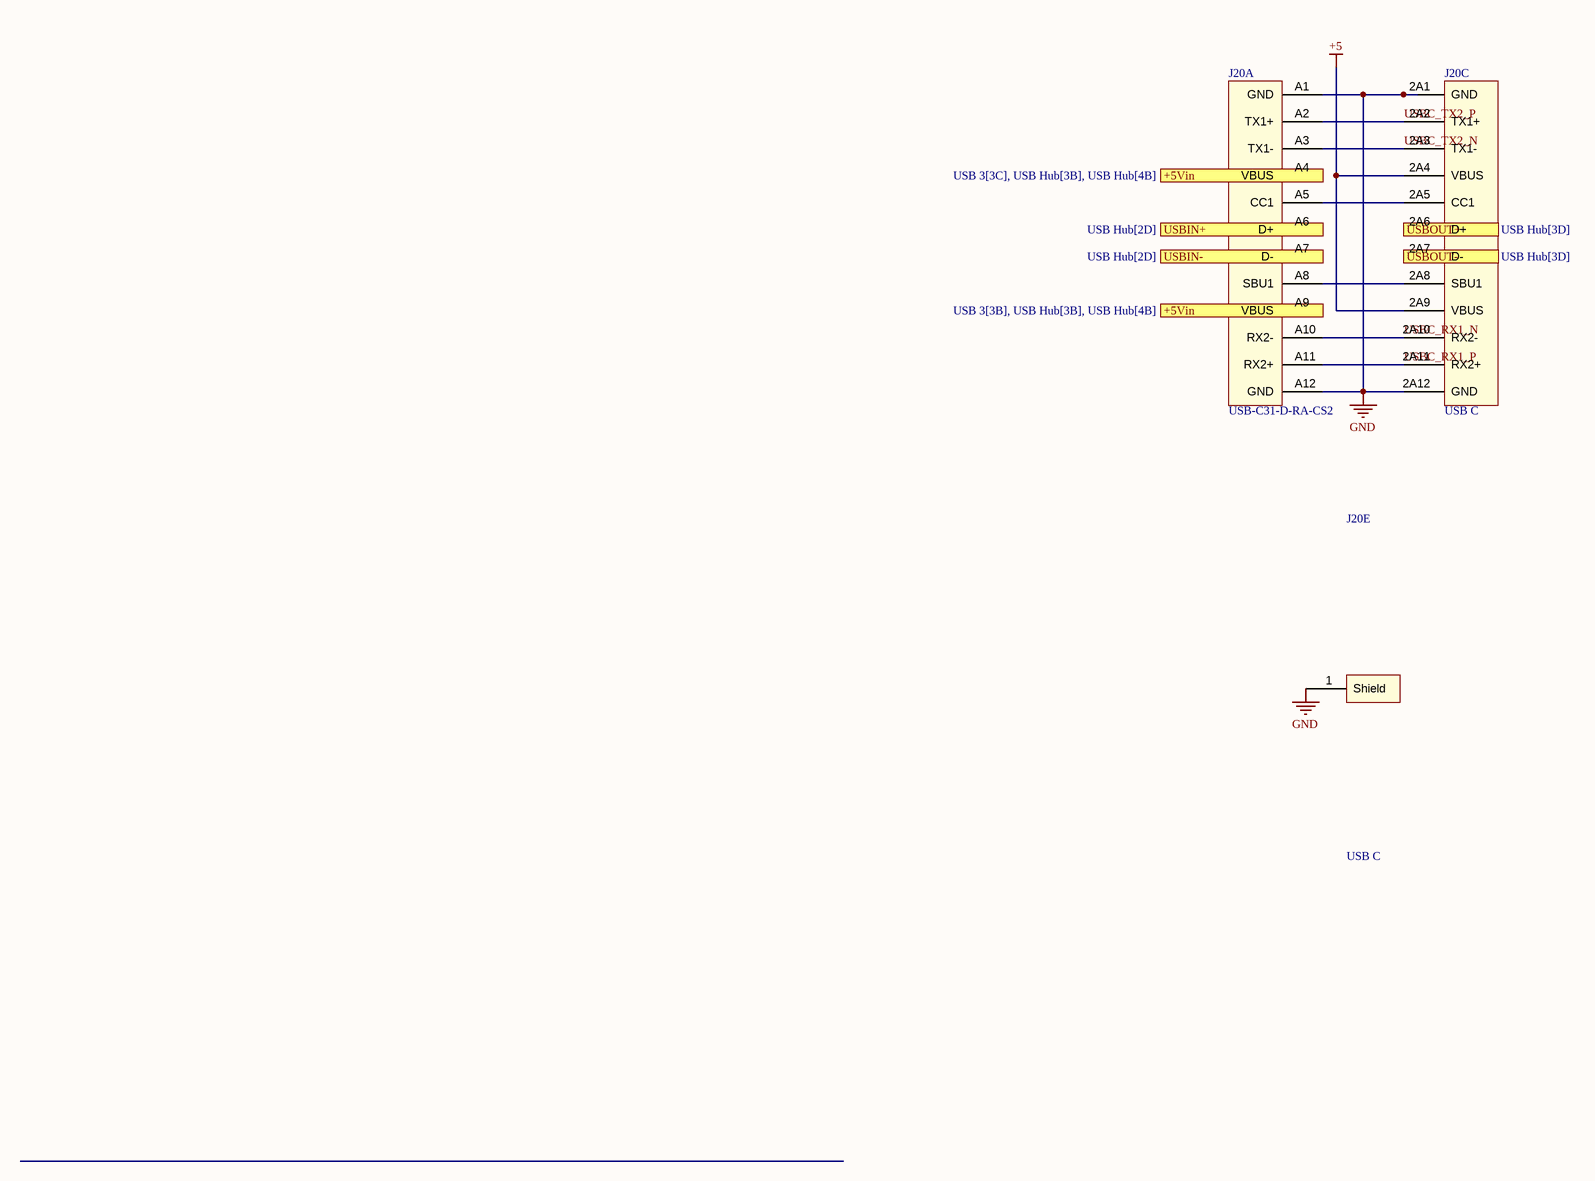
[diagram p5: USB 3.SchDoc]

### Parts
J20  USB-C31-D-RA-CS2  [Dual USB C Connector]  (parts A,C,E of 5)

### Ports
+5Vin (see USB 3[3B], USB Hub[3B], USB Hub[4B]), +5Vin (see USB 3[3C], USB Hub[3B], USB Hub[4B]), USBIN+ (see USB Hub[2D]), USBIN- (see USB Hub[2D]), USBOUT+ (see USB Hub[3D]), USBOUT- (see USB Hub[3D])

### Nets
+5: J20.2A4(VBUS) J20.2A9(VBUS)
GND: J20.1(Shield) J20.2A1(GND) J20.2A12(GND) J20.A1(GND) J20.A12(GND)
USB_IN_N: J20.A7(D-) ; port USBIN-
USB_IN_P: J20.A6(D+) ; port USBIN+
USBC_RX1_N: J20.2A10(RX2-) J20.A10(RX2-)
USBC_RX1_P: J20.2A11(RX2+) J20.A11(RX2+)
USBC_TX2_N: J20.2A3(TX1-) J20.A3(TX1-)
USBC_TX2_P: J20.2A2(TX1+) J20.A2(TX1+)
USBOUT_N: J20.2A7(D-) ; port USBOUT-
USBOUT_P: J20.2A6(D+) ; port USBOUT+
NetFB1_1: J20.A4(VBUS) J20.A9(VBUS) ; port +5Vin
NetJ20_2A5: J20.2A5(CC1) J20.A5(CC1)
NetJ20_2A8: J20.2A8(SBU1) J20.A8(SBU1)

### Notes on the sheet
- CREATIVE COMMONS
- PUBLIC LICENSE:
- BARKOUR ROBOT
- CC BY-NC 4.0
- APPROVED
- DWG NO
- GOOGLE LLC
- FILE
- RELEASED
- 2024/05/09
- SIZE
- 1600 AMPHITHEATRE PARKWAY
- MOUNTAIN VIEW CA 94043
- A3
- SHEET
- OF
- THIS DESIGN IS BEING PROVIDED  FOR NON-COMMERCIAL USE ONLY. THE USE OF =SCIENTIST_NAME_POSSESSIVE NAME IN CONNECTION WITH THE DESIGN IS NOT INTENDED TO IMPLY THAT =SCIENTIST_NAME SPONSORS OR ENDORSES THE DESIGN, GOOGLE LLC, OR ANY OF GOOGLE LLC'S PRODUCTS OR SERVICES.

### Library data of the parts
J20 = USB C: Dual USB C Connector